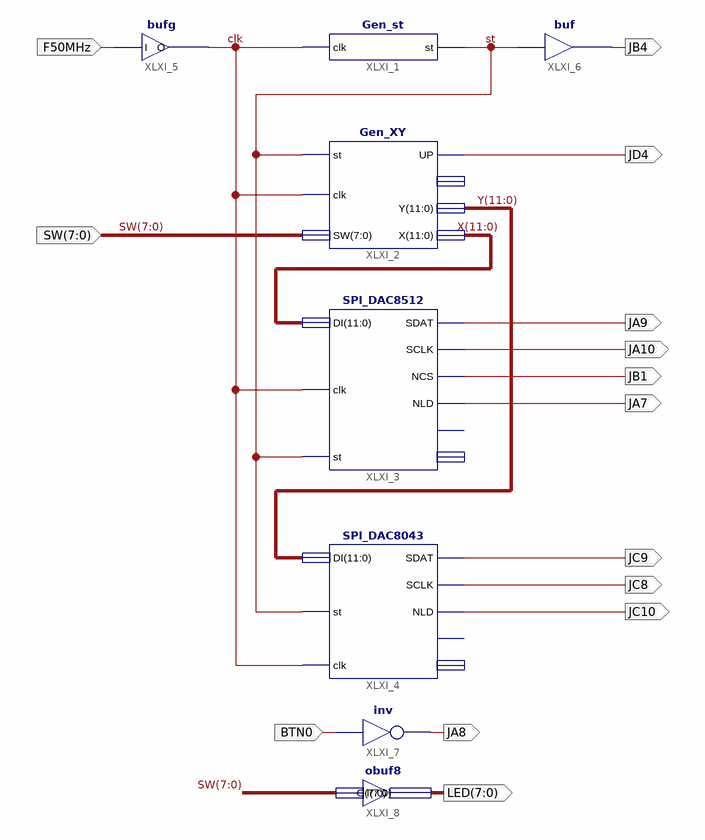
[diagram p0: schematic sheet 1]
// Xilinx ISE schematic Sch_LAB412L.sch (spartan3e) as structural Verilog: 8 symbols, 14 ports
module Sch_LAB412L (
  input  F50MHz,
  input  [7:0] SW,
  input  BTN0,
  output JB4,
  output JD4,
  output JA9,
  output JA10,
  output JB1,
  output JA7,
  output JC9,
  output JC8,
  output JC10,
  output JA8,
  output [7:0] LED
);

  wire clk, st;
  wire [11:0] X, Y;

  Gen_st XLXI_1 (.clk(clk), .st(st));
  Gen_XY XLXI_2 (.st(st), .clk(clk), .SW(SW), .UP(JD4), .X(X), .Y(Y));  // open: Q
  SPI_DAC8512 XLXI_3 (.clk(clk), .SDAT(JA9), .SCLK(JA10), .NCS(JB1), .NLD(JA7), .DI(X), .st(st));  // open: ce, cb_bit
  SPI_DAC8043 XLXI_4 (.SDAT(JC9), .SCLK(JC8), .NLD(JC10), .clk(clk), .st(st), .DI(Y));  // open: ce, cb_bit
  bufg XLXI_5 (.I(F50MHz), .O(clk));
  buf XLXI_6 (JB4, st);
  not XLXI_7 (JA8, BTN0);
  obuf8 XLXI_8 (.I(SW), .O(LED));
endmodule
